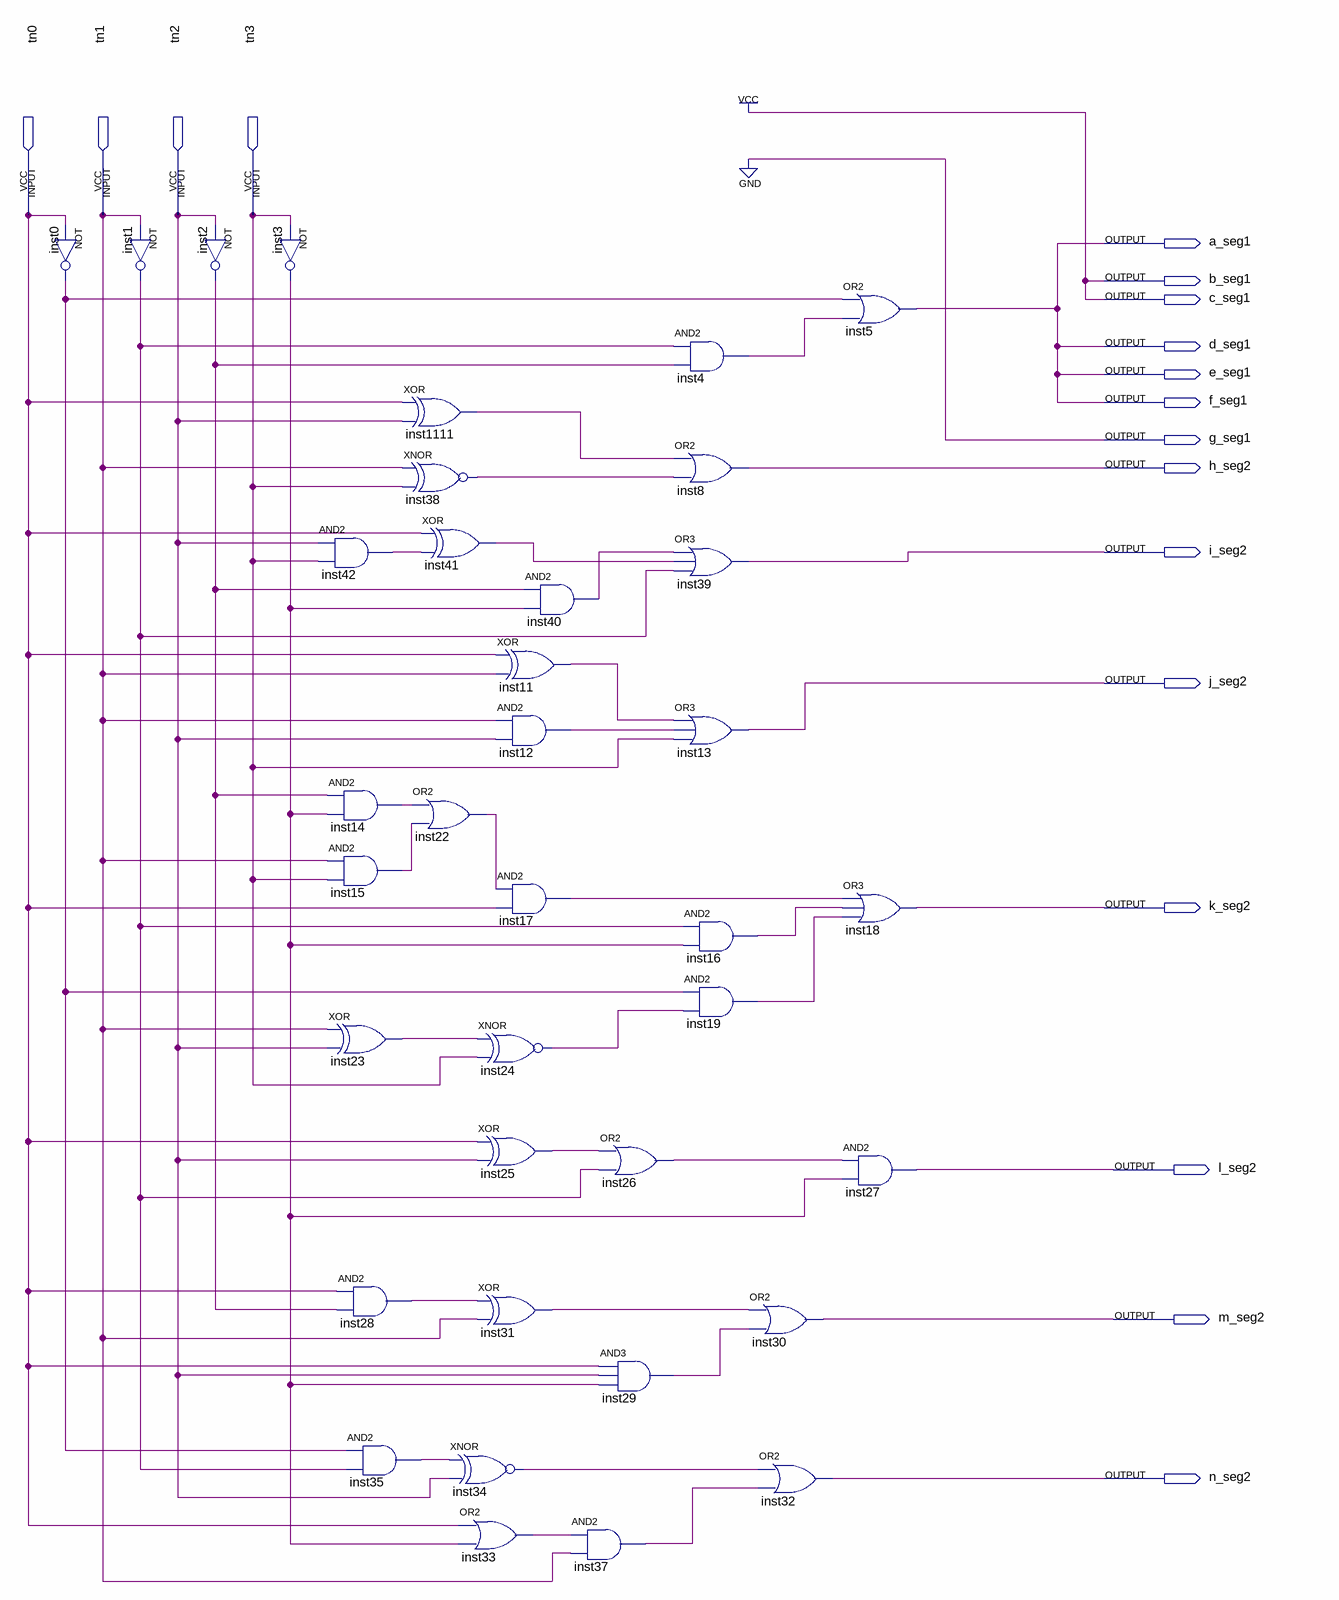
[diagram p0: schematic sheet]
// Quartus schematic table2segDecoder.bdf as structural Verilog: 37 symbols, 18 pins
module table2segDecoder (
  input  tn0,
  input  tn1,
  input  tn2,
  input  tn3,
  output a_seg1,
  output b_seg1,
  output c_seg1,
  output d_seg1,
  output e_seg1,
  output f_seg1,
  output g_seg1,
  output h_seg2,
  output i_seg2,
  output j_seg2,
  output k_seg2,
  output l_seg2,
  output m_seg2,
  output n_seg2
);

  wire inst0_out, inst1_out, inst2_out, inst3_out, inst4_out, inst11_out, inst12_out, inst14_out, inst15_out,
       inst16_out, inst17_out, inst19_out, inst22_out, inst23_out, inst24_out, inst25_out, inst26_out,
       inst28_out, inst29_out, inst31_out, inst33_out, inst34_out, inst35_out, inst37_out, inst38_out,
       inst40_out, inst41_out, inst42_out, inst1111_out;

  not inst0 (inst0_out, tn0);
  not inst1 (inst1_out, tn1);
  not inst2 (inst2_out, tn2);
  not inst3 (inst3_out, tn3);
  and inst42 (inst42_out, tn2, tn3);
  and inst14 (inst14_out, inst2_out, inst3_out);
  and inst15 (inst15_out, tn1, tn3);
  xor inst23 (inst23_out, tn1, tn2);
  and inst28 (inst28_out, tn0, inst2_out);
  and inst35 (inst35_out, inst0_out, inst1_out);
  xor inst1111 (inst1111_out, tn0, tn2);
  xnor inst38 (inst38_out, tn1, tn3);
  xor inst41 (inst41_out, tn0, inst42_out);
  or inst22 (inst22_out, inst14_out, inst15_out);
  xor inst11 (inst11_out, tn0, tn1);
  and inst12 (inst12_out, tn1, tn2);
  and inst17 (inst17_out, inst22_out, tn0);
  xnor inst24 (inst24_out, inst23_out, tn3);
  xor inst25 (inst25_out, tn0, tn2);
  xor inst31 (inst31_out, inst28_out, tn1);
  xnor inst34 (inst34_out, inst35_out, tn2);
  or inst33 (inst33_out, tn0, inst3_out);
  and inst40 (inst40_out, inst2_out, inst3_out);
  and inst37 (inst37_out, inst33_out, tn1);
  or inst26 (inst26_out, inst25_out, inst1_out);
  and inst29 (inst29_out, tn0, tn2, inst3_out);
  and inst4 (inst4_out, inst1_out, inst2_out);
  or inst8 (h_seg2, inst1111_out, inst38_out);
  or inst39 (i_seg2, inst40_out, inst41_out, inst1_out);
  or inst13 (j_seg2, inst11_out, inst12_out, tn3);
  and inst16 (inst16_out, inst1_out, inst3_out);
  and inst19 (inst19_out, inst0_out, inst24_out);
  or inst30 (m_seg2, inst31_out, inst29_out);
  or inst32 (n_seg2, inst34_out, inst37_out);
  or inst5 (a_seg1, inst0_out, inst4_out);
  or inst18 (k_seg2, inst17_out, inst16_out, inst19_out);
  and inst27 (l_seg2, inst26_out, inst3_out);

  assign b_seg1 = 1'b1;
  assign c_seg1 = 1'b1;
  assign d_seg1 = a_seg1;
  assign e_seg1 = a_seg1;
  assign f_seg1 = a_seg1;
  assign g_seg1 = 1'b0;
endmodule
